# EAGLE design pc (EAGLE 9.6.2)
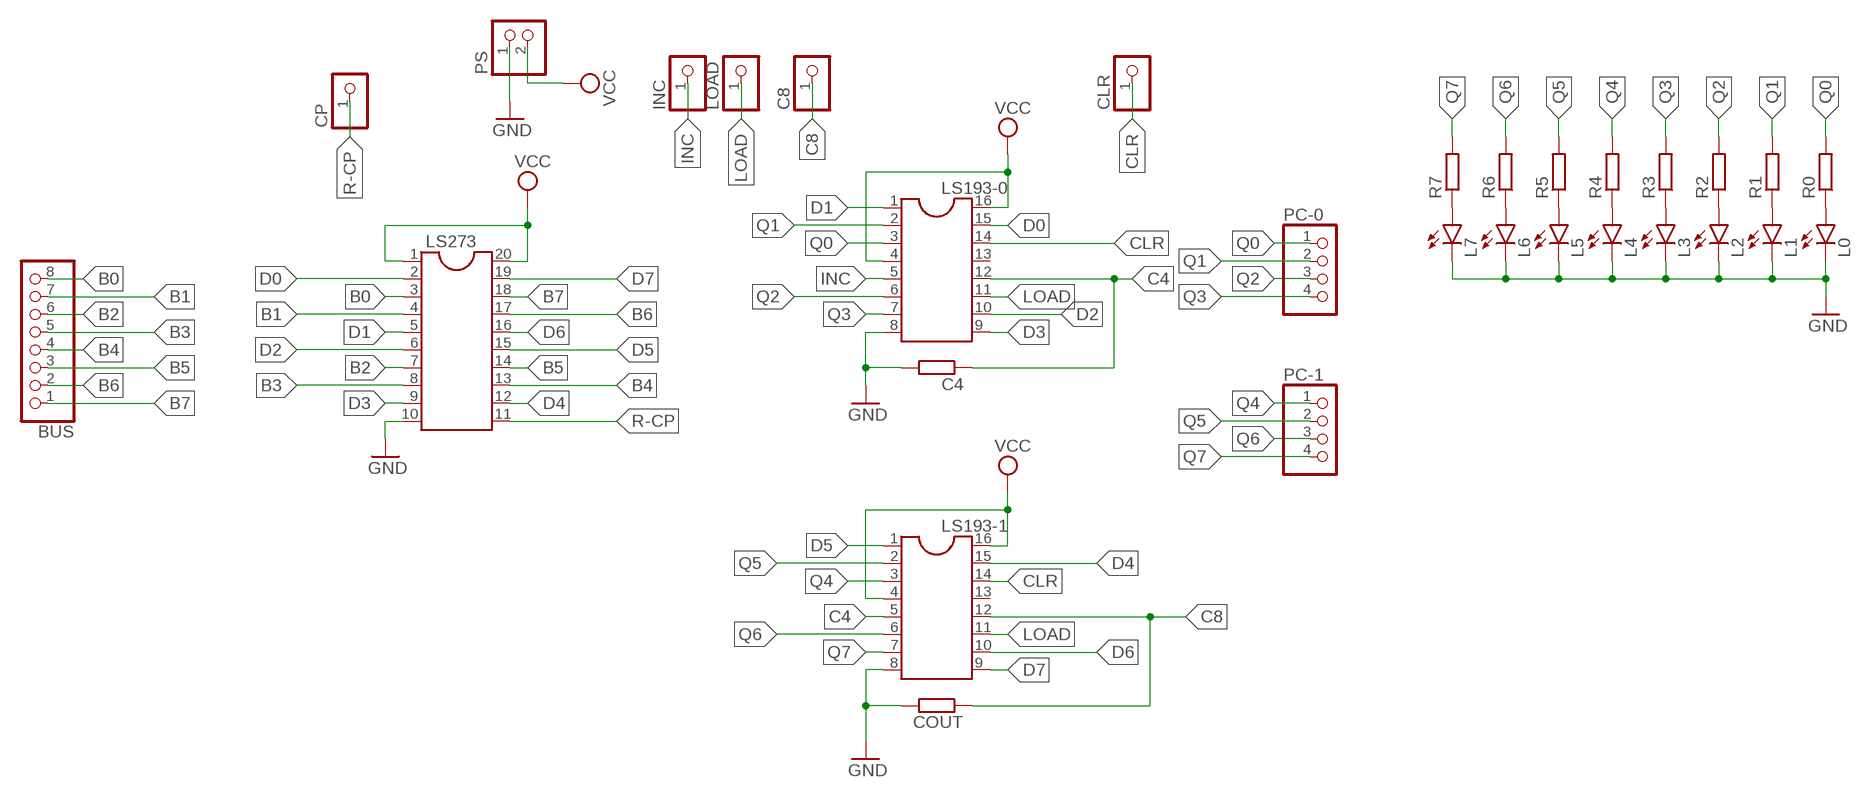
[diagram p0: schematic, sheet 1]

## Parts
BUS  PINHD-1X8  [1X08]
C4  R-EU_0204/7  [0204/7]
C8  PINHD-1X1  [1X01]
CLR  PINHD-1X1  [1X01]
COUT  R-EU_0204/7  [0204/7]
CP  PINHD-1X1  [1X01]
INC  PINHD-1X1  [1X01]
L0  LED5MM  [LED5MM]
L1  LED5MM  [LED5MM]
L2  LED5MM  [LED5MM]
L3  LED5MM  [LED5MM]
L4  LED5MM  [LED5MM]
L5  LED5MM  [LED5MM]
L6  LED5MM  [LED5MM]
L7  LED5MM  [LED5MM]
LOAD  PINHD-1X1  [1X01]
LS193-0  DIL16S  [SOCKET-16]
LS193-1  DIL16S  [SOCKET-16]
LS273  DIL20S  [SOCKET-20]
PC-0  PINHD-1X4  [1X04]
PC-1  PINHD-1X4  [1X04]
PS  PINHD-1X2  [1X02]
R0  R-EU_0204/7  [0204/7]
R1  R-EU_0204/7  [0204/7]
R2  R-EU_0204/7  [0204/7]
R3  R-EU_0204/7  [0204/7]
R4  R-EU_0204/7  [0204/7]
R5  R-EU_0204/7  [0204/7]
R6  R-EU_0204/7  [0204/7]
R7  R-EU_0204/7  [0204/7]

## Nets
B0: BUS.8 LS273.3
B1: BUS.7 LS273.4
B2: BUS.6 LS273.7
B3: BUS.5 LS273.8
B4: BUS.4 LS273.13
B5: BUS.3 LS273.14
B6: BUS.2 LS273.17
B7: BUS.1 LS273.18
C4: C4.1 LS193-0.12 LS193-1.5
C8: C8.1 COUT.1 LS193-1.12
CLR: CLR.1 LS193-0.14 LS193-1.14
D0: LS193-0.15 LS273.2
D1: LS193-0.1 LS273.5
D2: LS193-0.10 LS273.6
D3: LS193-0.9 LS273.9
D4: LS193-1.15 LS273.12
D5: LS193-1.1 LS273.15
D6: LS193-1.10 LS273.16
D7: LS193-1.9 LS273.19
GND: C4.2 COUT.2 L0.K(C) L1.K(C) L2.K(C) L3.K(C) L4.K(C) L5.K(C) L6.K(C) L7.K(C) LS193-0.8 LS193-1.8 LS273.10 PS.1
INC: INC.1 LS193-0.5
LOAD: LOAD.1 LS193-0.11 LS193-1.11
N$1: L3.A R3.1
N$2: L2.A R2.1
N$3: L1.A R1.1
N$4: L0.A R0.1
N$5: L4.A R4.1
N$6: L5.A R5.1
N$7: L6.A R6.1
N$8: L7.A R7.1
Q0: LS193-0.3 PC-0.1 R0.2
Q1: LS193-0.2 PC-0.2 R1.2
Q2: LS193-0.6 PC-0.3 R2.2
Q3: LS193-0.7 PC-0.4 R3.2
Q4: LS193-1.3 PC-1.1 R4.2
Q5: LS193-1.2 PC-1.2 R5.2
Q6: LS193-1.6 PC-1.3 R6.2
Q7: LS193-1.7 PC-1.4 R7.2
R-CP: CP.1 LS273.11
VCC: LS193-0.4 LS193-0.16 LS193-1.4 LS193-1.16 LS273.1 LS273.20 PS.2
Unconnected: LS193-0.13 LS193-1.13

## Library data of the parts
BUS = pinhead:PINHD-1X8: PIN HEADER
C4 COUT R0 R1-R7 = rcl:R-EU_: RESISTOR, European symbol; SPICEPREFIX: R
C8 CLR CP INC LOAD = pinhead:PINHD-1X1: PIN HEADER
L0 L1-L7 = led:LED: LED OSRAM: - CHIPLED LG R971, LG N971, LY N971, LG Q971, LY Q971, LO R971, LY R971 LH N974, LH R974 LS Q976, LO Q976, LY Q976 LO Q996 - Hyper CHIPLED LW Q18S LB Q993, LB Q99A, LB R99A - SideLED LS A670, LO A670, LY A670, LG A670, LP A670 LB A673, LV A673, LT A673, LW A673 LH A674 LY A675 LS A676, LA A676, LO A676, LY A676, LW A676 LS A679, LY A679, LG A679 - Hyper Micro SIDELED® LS Y876, LA Y876, LO Y876, LY Y876 LT Y87S - SmartLED LW L88C, LW L88S LB L89C, LB L89S, LG L890 LS L89K, LO L89K, LY L89K LS L896, LA L896, LO L896, LY L896 - TOPLED LS T670, LO T670, LY T670, LG T670, LP T670 LSG T670, LSP T670, LSY T670, LOP T670, LYG T670 LG T671, LOG T671, LSG T671 LB T673, LV T673, LT T673, LW T673 LH T674 LS T676, LA T676, LO T676, LY T676, LB T676, LH T676, LSB T676, LW T676 LB T67C, LV T67C, LT T67C, LS T67K, LO T67K, LY T67K, LW E67C LS E67B, LA E67B, LO E67B, LY E67B, LB E67C, LV E67C, LT E67C LW T67C LS T679, LY T679, LG T679 LS T770, LO T770, LY T770, LG T770, LP T770 LB T773, LV T773, LT T773, LW T773 LH T774 LS E675, LA E675, LY E675, LS T675 LS T776, LA T776, LO T776, LY T776, LB T776 LHGB T686 LT T68C, LB T68C - Hyper Mini TOPLED® LB M676 - Mini TOPLED Santana® LG M470 LS M47K, LO M47K, LY M47K Source: http://www.osram.convergy.de LUXEON: - LUMILED® LXK2-PW12-R00, LXK2-PW12-S00, LXK2-PW14-U00, LXK2-PW14-V00 LXK2-PM12-R00, LXK2-PM12-S00, LXK2-PM14-U00 LXK2-PE12-Q00, LXK2-PE12-R00, LXK2-PE12-S00, LXK2-PE14-T00, LXK2-PE14-U00 LXK2-PB12-K00, LXK2-PB12-L00, LXK2-PB12-M00, LXK2-PB14-N00, LXK2-PB14-P00, LXK2-PB14-Q00 LXK2-PR12-L00, LXK2-PR12-M00, LXK2-PR14-Q00, LXK2-PR14-R00 LXK2-PD12-Q00, LXK2-PD12-R00, LXK2-PD12-S00 LXK2-PH12-R00, LXK2-PH12-S00 LXK2-PL12-P00, LXK2-PL12-Q00, LXK2-PL12-R00 Source: www.luxeon.com KINGBRIGHT: KA-3528ASYC Source: www.kingbright.com
LS193-0 LS193-1 = ic-package:DIL16: Dual In Line / Socket
LS273 = ic-package:DIL20: Dual In Line / Socket
PC-0 PC-1 = pinhead:PINHD-1X4: PIN HEADER
PS = pinhead:PINHD-1X2: PIN HEADER

## Board
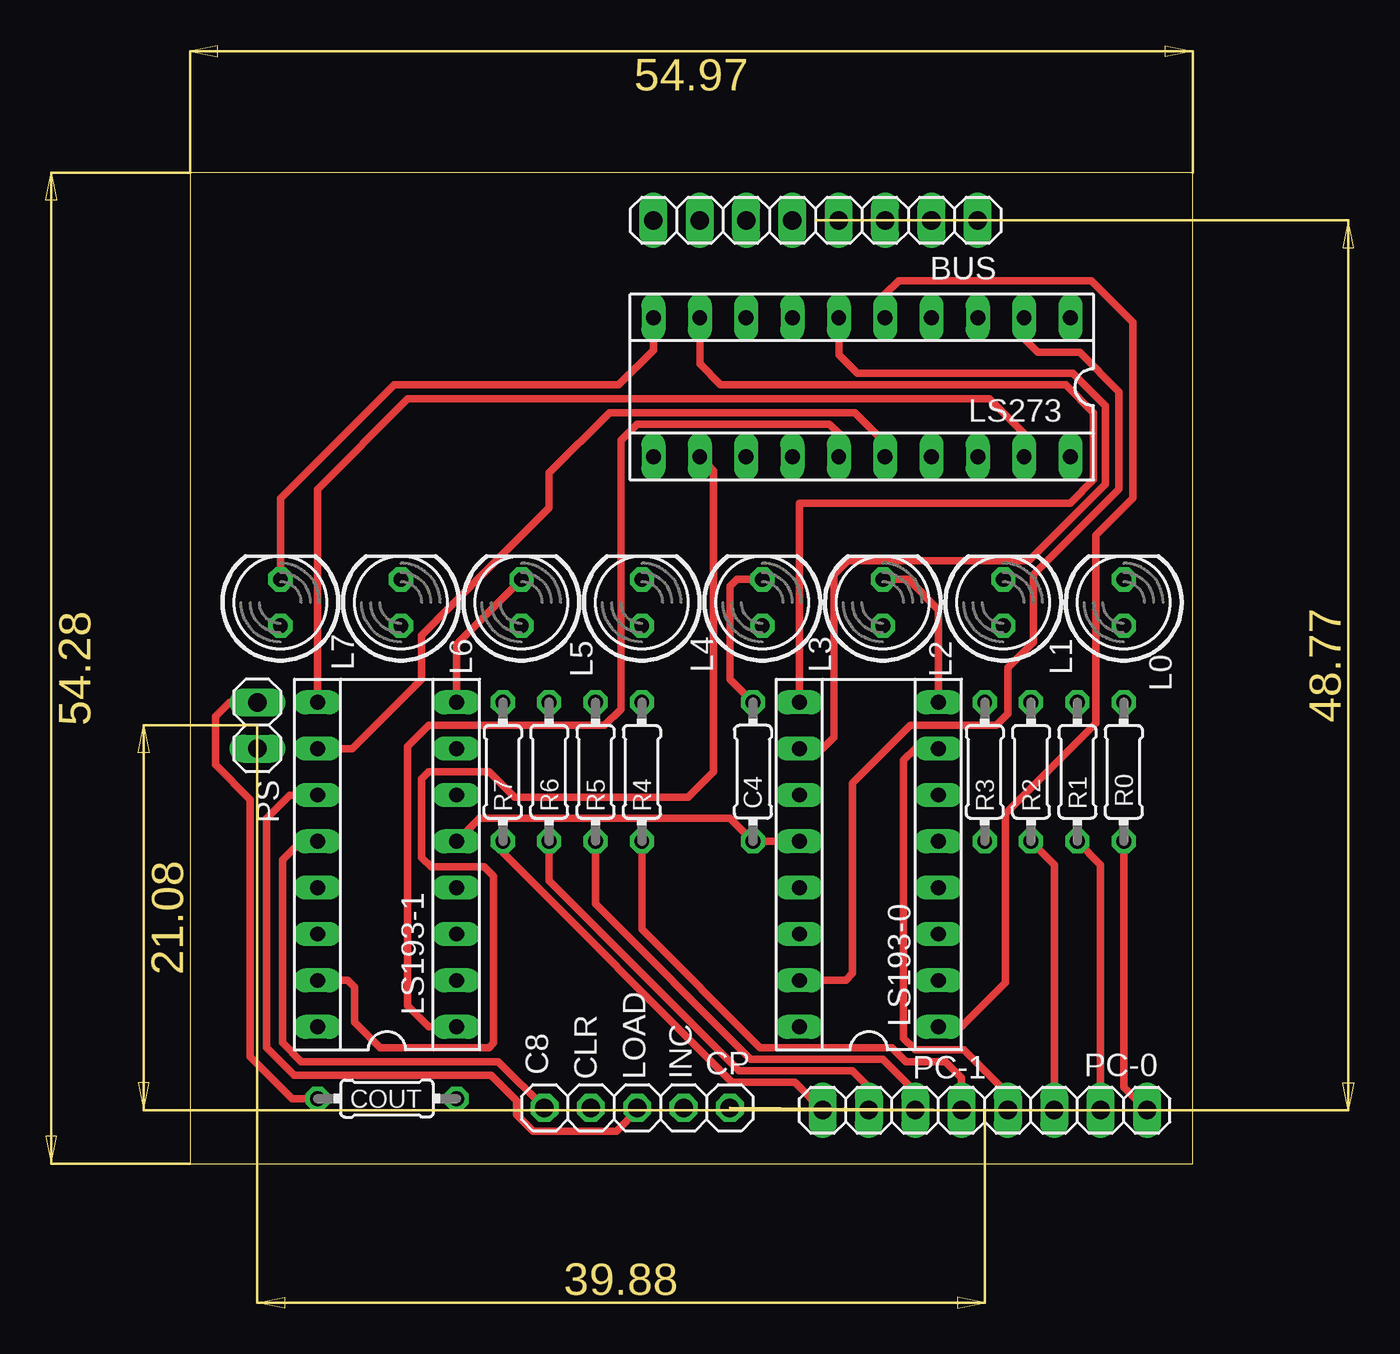
[diagram p1: board, top side]
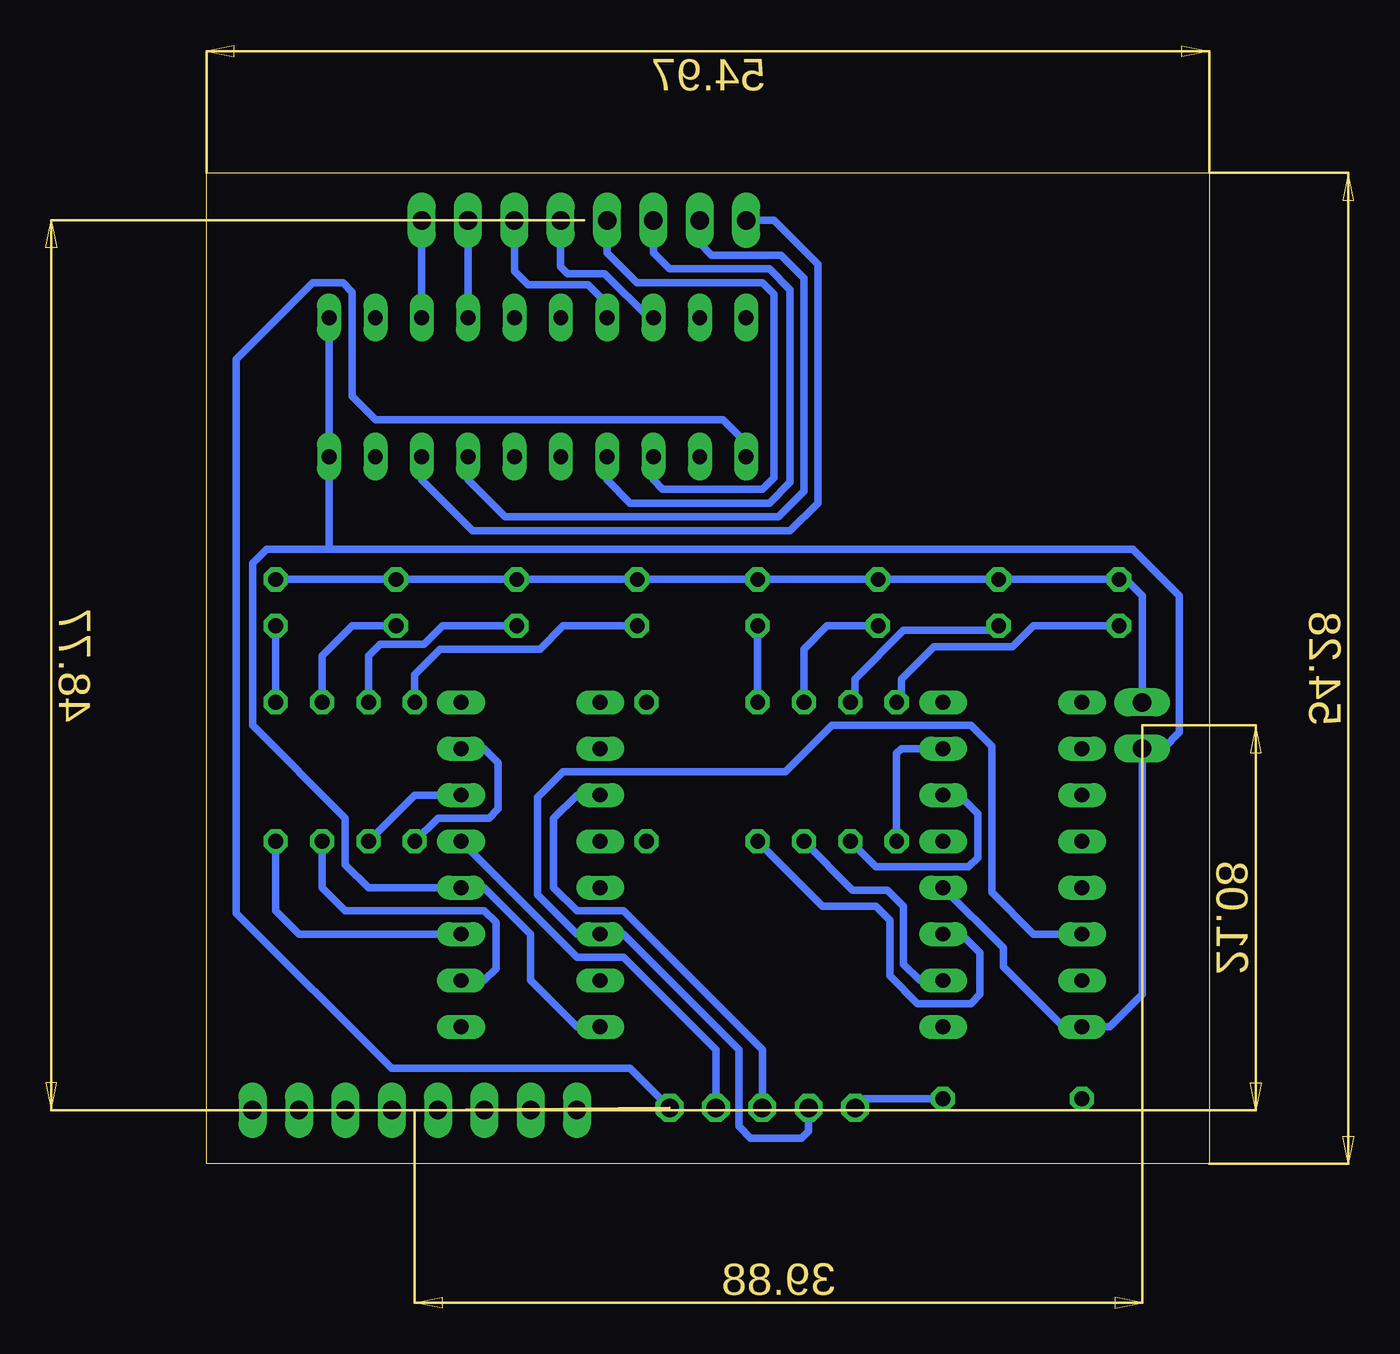
[diagram p2: board, bottom side, seen from below]

Size 54.97 x 54.28 mm. Coordinates in mm from the lower left corner, seen from the top.
Outline: 0,0 54.97,0 54.97,54.28 0,54.28 0,0
Copper layers (1*16): Top 0.035mm / dielectric 1.5mm / Bottom 0.035mm
Design rules "default": minimum track width 6mil, minimum drill 0.35mm, track to track 6mil, track to pad 6mil, pad to pad 6mil, via to via 6mil, smd to smd 6mil, copper to edge 40mil, drill to drill 6mil, minimum pad ring 10mil, minimum via ring 8mil, stop-mask expansion 4mil, vias tented up to drill 0mil, thermal gap 10mil

### Footprints (pad centres in the part's own frame; a part is rotated, then mirrored left to right if it is on the bottom)
1X08 = drill 1.016 long: 1 -8.89,0; 2 -6.35,0; 3 -3.81,0; 4 -1.27,0; 5 1.27,0; 6 3.81,0; 7 6.35,0; 8 8.89,0
0204/7 = drill 0.813 octagon: 1 -3.81,0; 2 3.81,0
1X01 = drill 1.016 octagon: 1 0,0
LED5MM = drill 0.813 octagon: A -1.27,0; K 1.27,0
SOCKET-16 = drill 0.813 long: 1 -8.89,-3.81; 2 -6.35,-3.81; 3 -3.81,-3.81; 4 -1.27,-3.81; 5 1.27,-3.81; 6 3.81,-3.81; 7 6.35,-3.81; 8 8.89,-3.81; 9 8.89,3.81; 10 6.35,3.81; 11 3.81,3.81; 12 1.27,3.81; 13 -1.27,3.81; 14 -3.81,3.81; 15 -6.35,3.81; 16 -8.89,3.81
SOCKET-20 = drill 0.813 long: 1 -11.43,-3.81; 2 -8.89,-3.81; 3 -6.35,-3.81; 4 -3.81,-3.81; 5 -1.27,-3.81; 6 1.27,-3.81; 7 3.81,-3.81; 8 6.35,-3.81; 9 8.89,-3.81; 10 11.43,-3.81; 11 11.43,3.81; 12 8.89,3.81; 13 6.35,3.81; 14 3.81,3.81; 15 1.27,3.81; 16 -1.27,3.81; 17 -3.81,3.81; 18 -6.35,3.81; 19 -8.89,3.81; 20 -11.43,3.81
1X04 = drill 1.016 long: 1 -3.81,0; 2 -1.27,0; 3 1.27,0; 4 3.81,0
1X02 = drill 1.016 long: 1 -1.27,0; 2 1.27,0

### Placement (x,y rotation side)
BUS  34.29,51.69 0 top
C4  30.86,21.46 90 top
C8  19.43,3.05 0 top
CLR  21.97,3.05 0 top
COUT  10.79,3.56 180 top
CP  29.59,3.05 0 top
INC  27.05,3.05 0 top
L0  51.18,30.73 90 top
L1  44.58,30.73 90 top
L2  37.97,30.73 90 top
L3  31.37,30.73 90 top
L4  24.77,30.73 90 top
L5  18.16,30.73 90 top
L6  11.56,30.73 90 top
L7  4.95,30.73 90 top
LOAD  24.51,3.05 0 top
LS193-0  37.21,16.38 90 top
LS193-1  10.79,16.38 90 top
LS273  36.83,42.55 180 top
PC-0  48.64,2.92 180 top
PC-1  38.48,2.92 180 top
PS  3.68,24 270 top
R0  51.18,21.46 270 top
R1  48.64,21.46 270 top
R2  46.1,21.46 270 top
R3  43.56,21.46 270 top
R4  24.77,21.46 270 top
R5  22.23,21.46 270 top
R6  19.68,21.46 270 top
R7  17.14,21.46 270 top

### Tracks (layer width: path | path; a pad name or v marks a point on that pad's centre or on a via)
B0
  Bottom 0.4: BUS.8 LS273.3
B1
  Bottom 0.4: LS273.4 BUS.7
B2
  Bottom 0.4: LS273.7 33.02,47.12 34.06,48.16 37.36,48.16 38.1,48.9 BUS.6
B3
  Bottom 0.4: BUS.5 35.56,49.15 35.18,48.77 33.15,48.77 30.73,46.35 LS273.8
B4
  Bottom 0.4: BUS.4 33.02,49.91 31.37,48.26 24.51,48.26 23.88,47.62 23.88,37.59 24.51,36.96 29.97,36.96 30.48,37.47 LS273.13
B5
  Bottom 0.4: LS273.14 33.02,37.47 31.75,36.2 24.13,36.2 22.99,37.34 22.99,47.88 24.13,49.02 29.59,49.02 30.48,49.91 BUS.3
B6
  Bottom 0.4: LS273.17 40.64,37.47 38.61,35.43 23.62,35.43 22.23,36.83 22.23,48.51 23.5,49.78 27.3,49.78 27.94,50.42 BUS.2
B7
  Bottom 0.4: LS273.18 43.18,37.47 40.39,34.67 22.99,34.67 21.46,36.2 21.46,49.28 23.88,51.69 BUS.1
C4
  Top 0.4: LS193-0.12 C4.1 29.59,18.92 15.88,18.92 LS193-1.5
C8
  Top 0.4: C8.1 16.89,5.59 6.1,5.59 5.08,6.6 5.08,16.64 6.1,17.65 LS193-1.12
  Bottom 0.4: COUT.1 18.92,3.56 C8.1
CLR
  Bottom 0.4: LS193-1.14 9.65,12.57 11.94,14.86 11.94,22.86 13.08,24 20.7,24 23.24,21.46 35.43,21.46 36.83,20.07 36.83,14.73 34.67,12.57 LS193-0.14 32.13,12.57 25.78,6.22 25.78,2.03 25.15,1.4 22.35,1.4 21.97,1.78 CLR.1
D0
  Top 0.4: LS193-0.15 35.94,10.03 36.32,10.41 36.32,20.83 39.5,24 44.2,24 44.83,24.64 44.83,27.18 46.23,28.57 46.23,32.26 50.93,36.96 50.93,42.29 48.77,44.45 46.48,44.45 45.72,45.21 LS273.2
D1
  Top 0.4: LS193-0.1 42.29,7.49 44.7,9.91 44.7,19.18 49.66,24.13 49.66,34.42 51.69,36.45 51.69,46.1 49.4,48.39 38.86,48.39 38.1,47.62 LS273.5
D2
  Top 0.4: LS193-0.10 34.67,22.73 35.31,23.37 35.31,32.26 36.07,33.02 45.97,33.02 50.16,37.21 50.16,41.53 48.39,43.31 36.58,43.31 35.56,44.32 LS273.6
D3
  Top 0.4: LS193-0.9 33.4,36.2 48.26,36.2 49.53,37.47 49.53,41.15 48.01,42.67 29.08,42.67 27.94,43.81 LS273.9
D4
  Top 0.4: LS193-1.15 8.64,10.03 9.02,9.65 9.02,7.75 10.41,6.35 16.38,6.35 16.64,6.6 16.64,15.75 16.13,16.26 13.21,16.26 12.7,16.76 12.7,21.08 13.08,21.46 16.38,21.46 17.78,20.07 27.3,20.07 28.7,21.46 28.7,37.97 LS273.12
D5
  Top 0.4: LS193-1.1 13.08,7.49 11.94,8.64 11.94,22.86 13.08,24 22.73,24 23.62,24.89 23.62,39.62 24.51,40.51 35.05,40.51 35.56,40.01 LS273.15
D6
  Top 0.4: LS193-1.10 8.89,22.73 12.7,26.54 12.7,28.96 19.68,35.94 19.68,37.85 22.99,41.15 36.45,41.15 38.1,39.5 LS273.16
D7
  Top 0.4: LS193-1.9 6.99,36.96 11.94,41.91 43.81,41.91 45.72,40.01 LS273.19
GND
  Top 0.4: LS193-0.8 41.02,30.35 39.37,32 L2.K | C4.2 29.59,26.54 29.59,31.62 29.97,32 L3.K | L5.K 14.61,28.45 LS193-1.8 | COUT.2 5.59,3.56 3.3,5.84 3.3,19.94 1.4,21.84 1.4,24.51 2.16,25.27 PS.1 | LS273.10 25.4,44.58 23.5,42.67 11.18,42.67 4.95,36.45 L7.K
  Bottom 0.4: L0.K L1.K L2.K L3.K L4.K L5.K L6.K L7.K 4.57,32 3.68,31.11 PS.1
INC
  Bottom 0.4: INC.1 27.05,6.22 32.13,11.3 34.67,11.3 LS193-0.5
LOAD
  Top 0.4: LS193-1.11 5.46,20.19 4.19,18.92 4.19,6.35 5.71,4.83 16.51,4.83 17.91,3.43 17.91,2.67 18.8,1.78 23.37,1.78 24.51,2.92 LOAD.1
  Bottom 0.4: LOAD.1 24.51,6.22 32.13,13.84 34.67,13.84 35.94,15.11 35.94,18.92 34.67,20.19 LS193-0.11
N$1
  Bottom 0.4: L3.A 35.43,29.46 36.7,28.19 42.16,28.19 43.56,26.8 R3.1
N$2
  Bottom 0.4: L2.A 42.04,29.46 43.05,28.45 45.47,28.45 46.1,27.81 R2.1
N$3
  Bottom 0.4: R1.1 48.64,27.81 46.99,29.46 L1.A
N$4
  Bottom 0.4: R0.1 L0.A
N$5
  Bottom 0.4: R4.1 L4.A
N$6
  Bottom 0.4: L5.A 20.95,29.46 22.23,28.19 R5.1
N$7
  Bottom 0.4: R6.1 19.43,25.53 19.43,26.54 16.76,29.21 11.81,29.21 L6.A
N$8
  Bottom 0.4: R7.1 16.89,25.53 16.89,26.54 15.11,28.32 10.79,28.32 9.65,29.46 L7.A
Q0
  Top 0.4: R0.2 51.18,4.19 PC-0.1
  Bottom 0.4: 42.29,12.57 LS193-0.3 49.91,12.57 51.18,13.84 R0.2
Q1
  Top 0.4: R1.2 49.91,16.38 PC-0.2
  Bottom 0.4: LS193-0.2 39.75,10.03 39.12,10.67 39.12,13.21 39.75,13.84 47.37,13.84 48.64,15.11 R1.2
Q2
  Top 0.4: R2.2 47.37,16.38 PC-0.3
  Bottom 0.4: LS193-0.6 43.56,20.19 R2.2
Q3
  Top 0.4: LS193-0.7 39.75,22.73 39.12,22.1 39.12,6.86 39.75,6.22 42.42,6.22 44.83,3.81 PC-0.4
  Bottom 0.4: R3.2 42.29,18.92 39.5,18.92 38.99,19.43 38.99,21.97 39.75,22.73 LS193-0.7
Q4
  Top 0.4: R4.2 24.77,12.83 31.24,6.35 38.48,6.35 39.24,5.59 41.4,5.59 42.29,4.7 PC-1.1
  Bottom 0.4: R4.2 21.21,14.1 18.29,14.1 17.53,13.34 17.53,10.29 16,8.76 13.08,8.76 12.57,9.27 12.57,11.56 13.59,12.57 LS193-1.3
Q5
  Top 0.4: R5.2 22.23,14.22 30.73,5.71 37.97,5.71 39.75,3.94 PC-1.2
  Bottom 0.4: R5.2 19.56,14.99 17.65,14.99 16.76,14.1 16.76,10.92 15.88,10.03 LS193-1.2
Q6
  Top 0.4: R6.2 19.68,15.49 30.1,5.08 36.32,5.08 37.21,4.19 PC-1.3
  Bottom 0.4: R6.2 18.29,16.26 13.21,16.26 12.7,16.76 12.7,19.18 13.72,20.19 LS193-1.6
Q7
  Top 0.4: PC-1.4 33.15,4.45 29.72,4.45 17.14,17.02 R7.2
  Bottom 0.4: R7.2 17.14,22.48 16.89,22.73 LS193-1.7
R-CP
  Bottom 0.4: LS273.11 25.4,39.5 26.67,40.77 45.72,40.77 46.99,42.04 46.99,47.75 47.5,48.26 49.15,48.26 53.34,44.07 53.34,13.72 44.83,5.21 31.75,5.21 CP.1
VCC
  Bottom 0.4: LS193-0.16 34.67,7.49 37.21,10.03 37.21,12.57 39.75,15.11 LS193-0.4 46.1,15.11 47.37,16.38 47.37,18.92 52.45,24 52.45,32.89 51.69,33.66 48.26,33.66 | LS193-1.4 11.3,11.81 11.3,10.79 8,7.49 LS193-1.16 5.46,7.49 3.68,9.27 PS.2 2.54,22.73 1.65,23.62 1.65,31.11 4.19,33.66 48.26,33.66 | LS273.1 LS273.20 48.26,33.66